# Altium schematic sheet HE LNA.SchDoc
size A; SheetNumber: 8; SheetTotal: 12
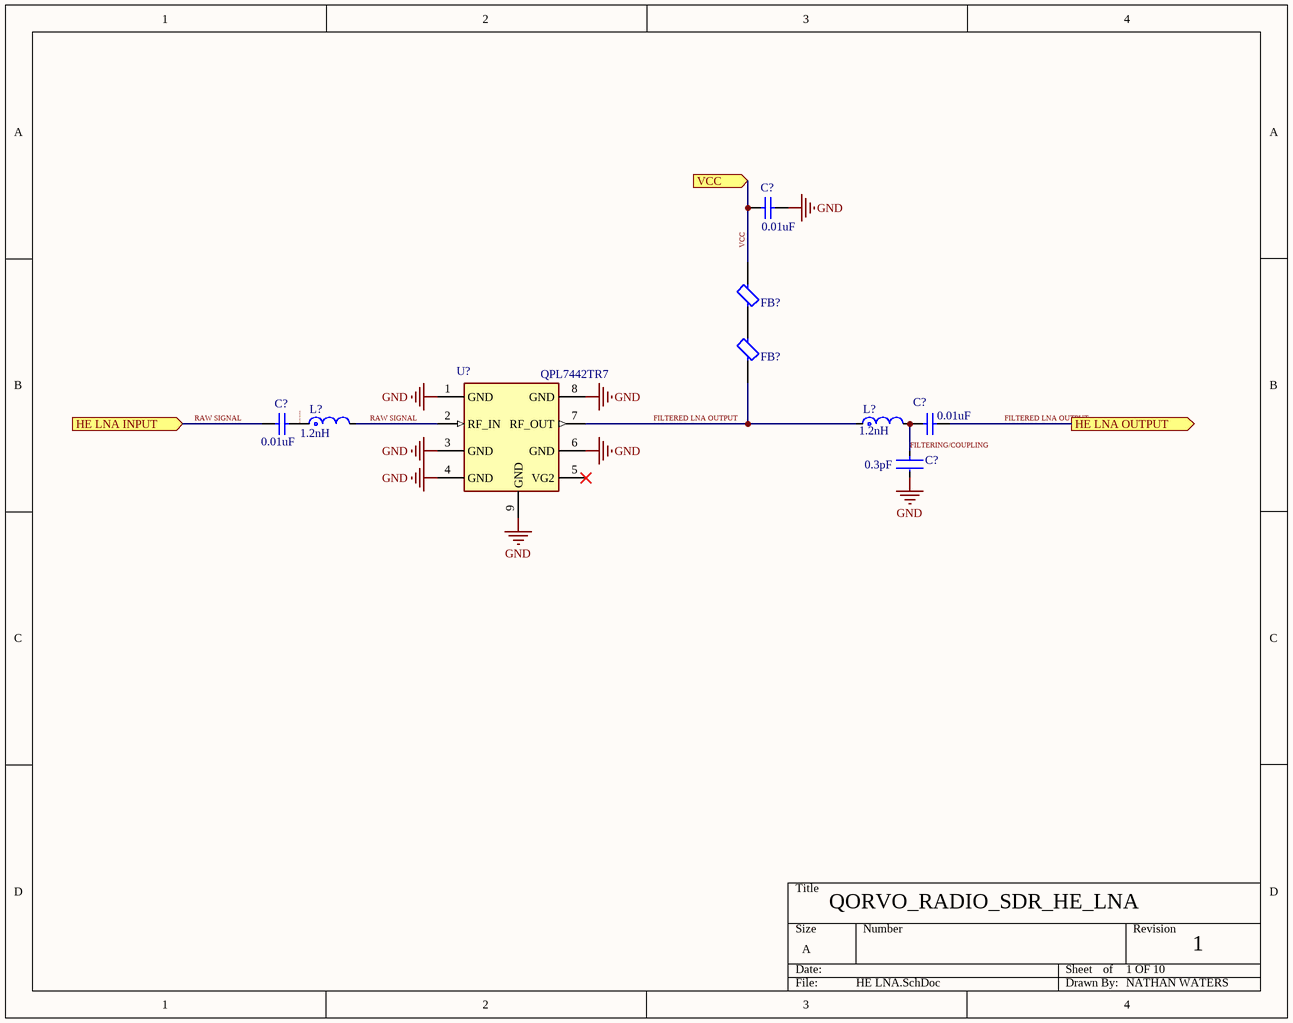
[diagram p0: HE LNA.SchDoc]

## Parts
(Parts that share a designator on the sheet are numbered #1, #2 ... from top to bottom, then left to right.)
C?#1  Capacitance: 0.01uF  [0402 CAP_INDUCTOR]  (hidden comment: GRM155R71C103KA01D)
C?#2  Capacitance: 0.01uF  [CAPC1005X55X25LL05T10]  (hidden comment: GRM155R71C103KA01D)
C?#3  Capacitance: 0.01uF  [CAPC1005X55X25LL05T10]  (hidden comment: GRM155R71C103KA01D)
C?#4  Capacitance: 0.3pF  [FP-GJM155-0_05-IPC_A]  (hidden comment: GJM1555C1HR30WB01D)
FB?#1  MMZ1005A182ET000  [0402 CAP_INDUCTOR]  (value not drawn)
FB?#2  MMZ1005A182ET000  [0402 CAP_INDUCTOR]  (value not drawn)
L?#1  INDUCTANCE: 1.2nH  [FP-LQG15HH_02-IPC_C]  (hidden comment: LQG15HN1N2B02D)
L?#2  INDUCTANCE: 1.2nH  [FP-LQG15HH_02-IPC_C]  (hidden comment: LQG15HN1N2B02D)
U?  QPL7442TR7  [QPL7442TR7]

## Ports
HE LNA INPUT (in), HE LNA OUTPUT (out, see HE Mixer[1C]), VCC (in, see 0.9V REG[3B], 3.3v REG[3B], HE Mixer[3C], LE LNA[3A], LE Mixer[3C], LPF[1B], SWITCH[3B])

## Nets
GND: C?#1.2 C?#4.2 U?.1(GND) U?.3(GND) U?.4(GND) U?.6(GND) U?.8(GND) U?.9(GND)
FILTERED LNA OUTPUT: C?#3.2 FB?#2.1 L?#2.1 U?.7(RF_OUT) ; port HE LNA OUTPUT
FILTERING/COUPLING: C?#3.1 C?#4.1 L?#2.2
RAW SIGNAL: C?#2.1 C?#2.2 L?#1.1 L?#1.2 U?.2(RF_IN) ; port HE LNA INPUT
VCC: C?#1.1 FB?#1.2 ; port VCC

Not connected (* = marked no-connect by the designer): FB?#1 1; FB?#2 2; U? 5(VG2)*

## Notes on the sheet
- QORVO_RADIO_SDR_HE_LNA
- 1 OF 10
- 1
- NATHAN WATERS

## Library data of the parts
C?#1 = CAP-NP-2: Chip Capacitor, 10 nF, 16 V, 10%, -55 to 125 degC, 0402 (1005 Metric), RoHS, Tape and Reel; Manufacturer: Murata; Rated Voltage: 16V; Dielectric: X7R; Manufacturer URL: http://www.murata.com/; Package Description: 2-Pin Surface Mount Device, Body 1 x 0.5 mm; Case Size/Dimension: 0402; Tolerance (%): ±10%; Datasheet Version: 06/2016; Package Reference: 0402; Mounting Technology: SurfaceMount; Datasheet URL: http://psearch.en.murata.com/capacitor/product/GRM155R71C103KA01%23.pdf
C?#2 C?#3 = CMP-2000-06332-1: Chip Capacitor, 10 nF, 16 V, 10%, -55 to 125 degC, 0402 (1005 Metric), RoHS, Tape and Reel; Manufacturer: Murata; Rated Voltage: 16V; Dielectric: X7R; Manufacturer URL: http://www.murata.com/; Package Description: 2-Pin Surface Mount Device, Body 1 x 0.5 mm; Case Size/Dimension: 0402; Tolerance (%): ±10%; Datasheet Version: 06/2016; Package Reference: 0402; Mounting Technology: SurfaceMount; Datasheet URL: http://psearch.en.murata.com/capacitor/product/GRM155R71C103KA01%23.pdf
C?#4 = CMP-2008-03901-2: Multi-Layer Ceramic Capacitor 0.3pF C0G  ±0.05pF 0402 Paper T/R; Voltage Rating (DC): 50V; Packaging: Tape and Reel; Length: 1mm; Min Operating Temperature: -55°C; Case Code (Metric): 1005; Package Quantity: 10000; Termination: SMD/SMT; Height: 0.5mm; Dielectric: C0G; Case Code (Imperial): 0402; Mount: Surface Mount; Max Operating Temperature: 125°C; Thickness: 0.022inch; Radiation Hardening: No; Voltage Rating: 50V; Lead Free: Lead Free; Depth: 0.5mm; Case/Package: 0402; Width: 0.02inch
FB?#1 FB?#2 = 5f30dd21d616792df468990f7003faa: Signal Line Ferrite Bead 1800Ω @ 100MHz 200mA DCR 2100mΩ SMD 0402; Impedance: 1.8kR; DC Resistance (DCR): 2.2R; Tolerance: 25%; RoHS Compliant: Yes; Case Code (Metric): 1005; Case Code (Imperial): 0402; Mount: Surface Mount; Width: 0.02inch; Lead Free: Lead Free; Package Quantity: 1; Core Material: Ferrite; Case/Package: 0402; Height: 0.022inch; Max DC Current: 200mA; Series: MMZ; Packaging: Tape and Reel; Current Rating: 200mA; Length: 0.039inch
L?#1 L?#2 = CMP-06042-012514-1: Multilayer type RF Inductor 1.2nH ±0.1nH 0.08Ω 1000mA 0402
U? = QPL7442TR7: LNA; Manufacturer_Name: Qorvo; Manufacturer_Part_Number: QPL7442TR7; Datasheet Link: https://www.qorvo.com/products/d/da007775